# EAGLE design RelayController (EAGLE 7.6.0)

## Sheet 1 of 3
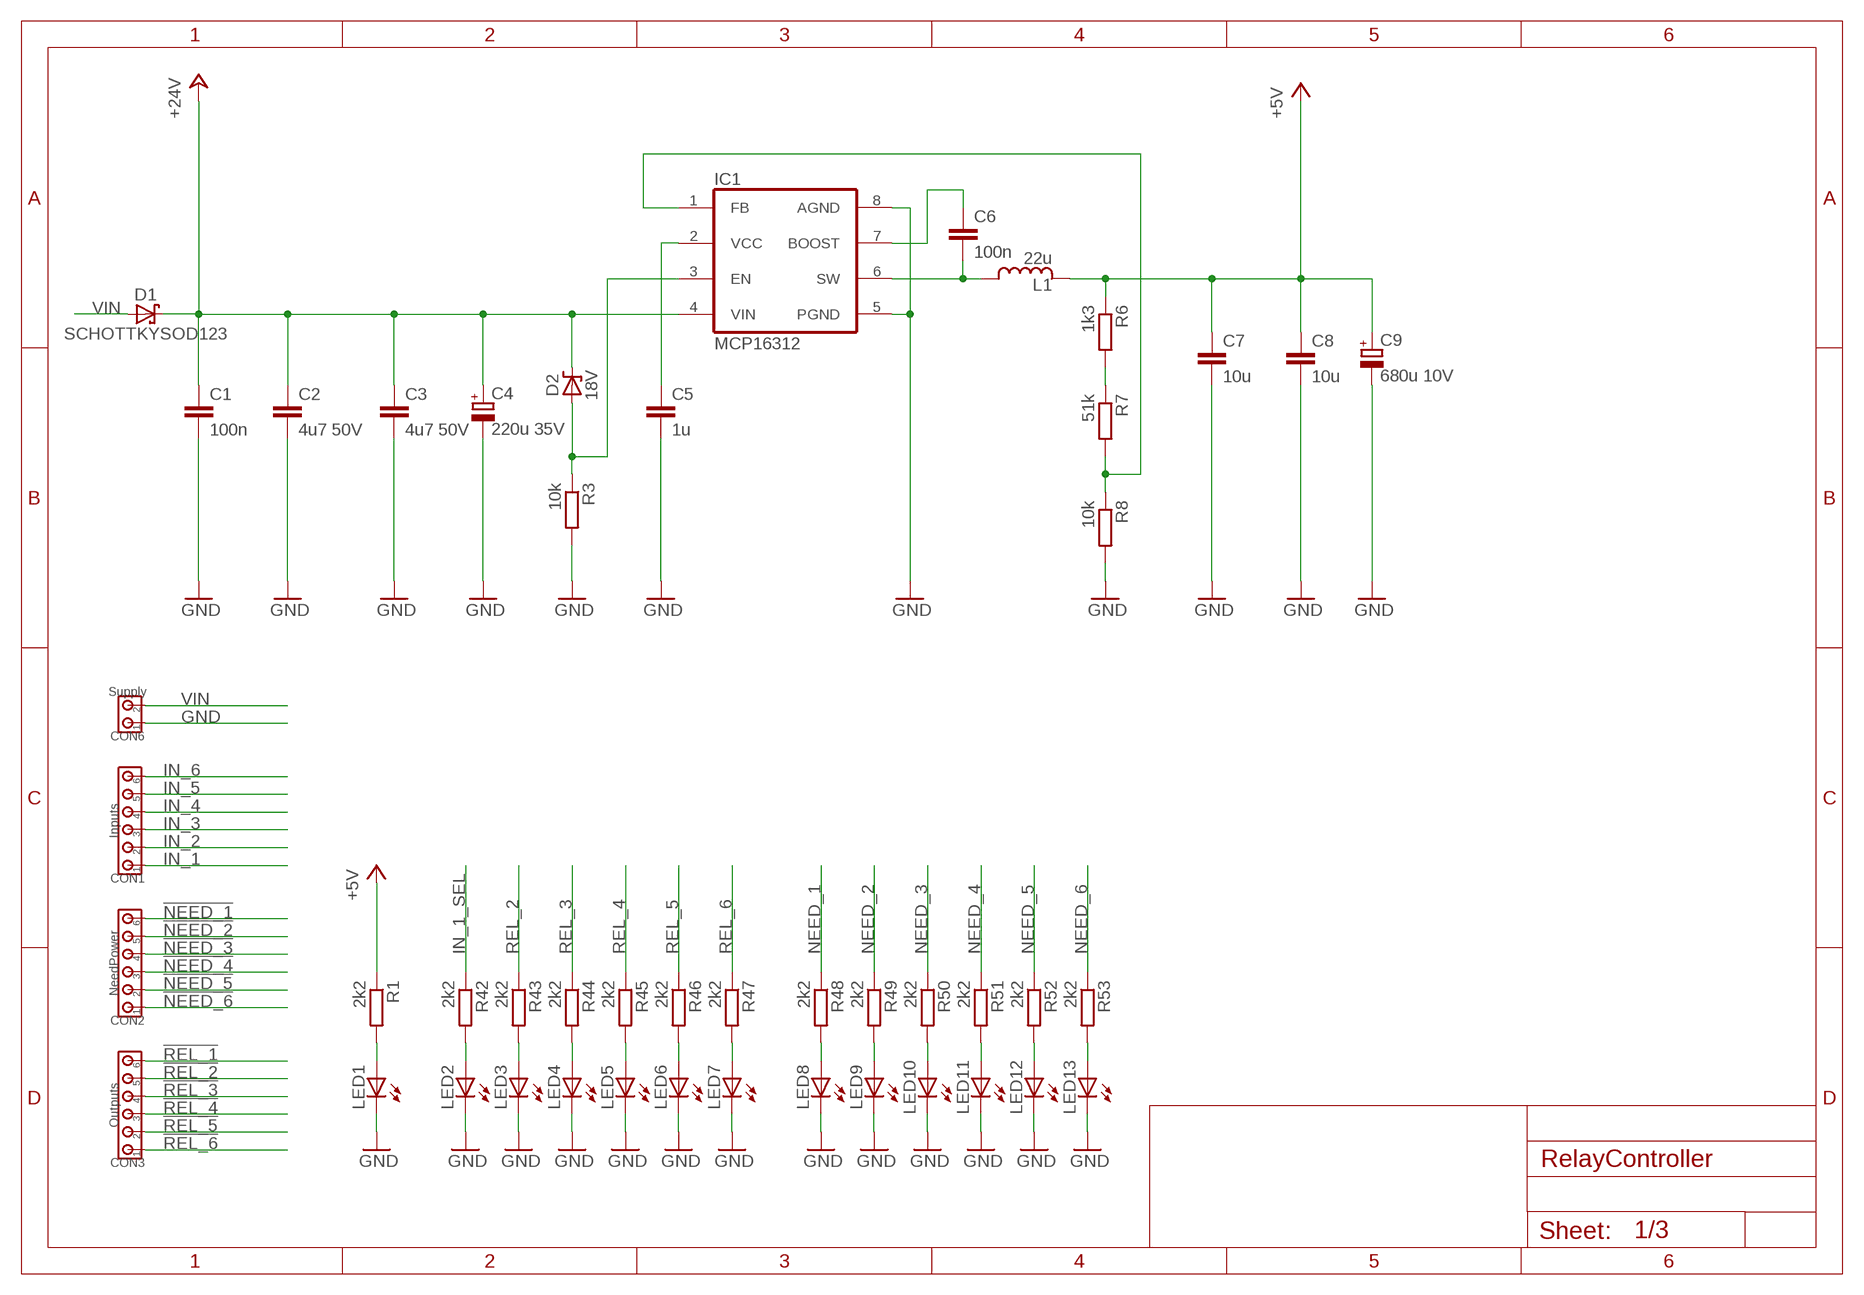
[diagram p0: schematic, sheet 1]

### Parts
C1  100n  CC0805  [C0805]
C2  4u7 50V  CC1206  [C1206]
C3  4u7 50V  CC1206  [C1206]
C4  220u 35V  C_POLARIZED8MM  [8MM]
C5  1u  CC0805  [C0805]
C6  100n  CC0805  [C0805]
C7  10u  CC0805  [C0805]
C8  10u  CC0805  [C0805]
C9  680u 10V  C_POLARIZED8MM  [8MM]
CON1  Inputs  CON_6X3.5MM  [3.5MM_6X]
CON2  NeedPower  CON_6X3.5MM  [3.5MM_6X]
CON3  Outputs  CON_6X3.5MM  [3.5MM_6X]
CON6  Supply  CON_2X3.5MM  [3.5MM_2X]
D1  SCHOTTKYSOD123  [SOD123]
D2  18V  ZENERSOD323  [SOD323]
IC1  MCP16312  MCP16311  [MSOP8]
L1  22u  INDUCTORSRN5040  [SRN5040]
LED1  LED0805_NB  [LED0805_NOBOARDER]
LED2  LED0805_NB  [LED0805_NOBOARDER]
LED3  LED0805_NB  [LED0805_NOBOARDER]
LED4  LED0805_NB  [LED0805_NOBOARDER]
LED5  LED0805_NB  [LED0805_NOBOARDER]
LED6  LED0805_NB  [LED0805_NOBOARDER]
LED7  LED0805_NB  [LED0805_NOBOARDER]
LED8  LED0805_NB  [LED0805_NOBOARDER]
LED9  LED0805_NB  [LED0805_NOBOARDER]
LED10  LED0805_NB  [LED0805_NOBOARDER]
LED11  LED0805_NB  [LED0805_NOBOARDER]
LED12  LED0805_NB  [LED0805_NOBOARDER]
LED13  LED0805_NB  [LED0805_NOBOARDER]
R1  2k2  RESISTORR0805  [R0805]
R3  10k  RESISTORR0805  [R0805]
R6  1k3  RESISTORR0805  [R0805]
R7  51k  RESISTORR0805  [R0805]
R8  10k  RESISTORR0805  [R0805]
R42  2k2  RESISTORR0805  [R0805]
R43  2k2  RESISTORR0805  [R0805]
R44  2k2  RESISTORR0805  [R0805]
R45  2k2  RESISTORR0805  [R0805]
R46  2k2  RESISTORR0805  [R0805]
R47  2k2  RESISTORR0805  [R0805]
R48  2k2  RESISTORR0805  [R0805]
R49  2k2  RESISTORR0805  [R0805]
R50  2k2  RESISTORR0805  [R0805]
R51  2k2  RESISTORR0805  [R0805]
R52  2k2  RESISTORR0805  [R0805]
R53  2k2  RESISTORR0805  [R0805]

### Nets
!NEED_1!: CON2.6 ; also sheet 2
!NEED_2!: CON2.5 ; also sheet 2
!NEED_3!: CON2.4 ; also sheet 2
!NEED_4!: CON2.3 ; also sheet 2
!NEED_5!: CON2.2 ; also sheet 2
!NEED_6!: CON2.1 ; also sheet 2
!REL_1!: CON3.6 ; also sheet 3
!REL_2!: CON3.5 ; also sheet 3
!REL_3!: CON3.4 ; also sheet 3
!REL_4!: CON3.3 ; also sheet 3
!REL_5!: CON3.2 ; also sheet 3
!REL_6!: CON3.1 ; also sheet 3
+5V: C7.1 C8.1 C9.+ L1.2 R1.1 R6.1 ; also sheet 2,3
+24V: C1.1 C2.1 C3.1 C4.+ D1.C D2.C IC1.4(VIN) ; also sheet 2,3
BOOST: C6.1 IC1.7(BOOST)
GND: C1.2 C2.2 C3.2 C4.- C5.2 C7.2 C8.2 C9.- CON6.1 IC1.5(PGND) IC1.8(AGND) LED1.C LED2.C LED3.C LED4.C LED5.C LED6.C LED7.C LED8.C LED9.C LED10.C LED11.C LED12.C LED13.C R3.2 R8.2 ; also sheet 2,3
IN_1: CON1.1 ; also sheet 2
IN_1_SEL: R42.1 ; also sheet 2
IN_2: CON1.2 ; also sheet 2
IN_3: CON1.3 ; also sheet 2
IN_4: CON1.4 ; also sheet 2
IN_5: CON1.5 ; also sheet 2
IN_6: CON1.6 ; also sheet 2
N$1: IC1.1(FB) R7.2 R8.1
N$6: LED1.A R1.2
N$8: D2.A IC1.3(EN) R3.1
N$13: R6.2 R7.1
N$14: C5.1 IC1.2(VCC)
N$17: LED2.A R42.2
N$18: LED3.A R43.2
N$19: LED4.A R44.2
N$20: LED5.A R45.2
N$21: LED6.A R46.2
N$22: LED7.A R47.2
N$23: LED8.A R48.2
N$24: LED9.A R49.2
N$25: LED10.A R50.2
N$26: LED11.A R51.2
N$27: LED12.A R52.2
N$28: LED13.A R53.2
NEED_1: R48.1 ; also sheet 2
NEED_2: R49.1 ; also sheet 2
NEED_3: R50.1 ; also sheet 2
NEED_4: R51.1 ; also sheet 2
NEED_5: R52.1 ; also sheet 2
NEED_6: R53.1 ; also sheet 2
REL_2: R43.1 ; also sheet 2,3
REL_3: R44.1 ; also sheet 2,3
REL_4: R45.1 ; also sheet 2,3
REL_5: R46.1 ; also sheet 2,3
REL_6: R47.1 ; also sheet 2,3
SWITCH: C6.2 IC1.6(SW) L1.1
VIN: CON6.2 D1.A

## Sheet 2 of 3
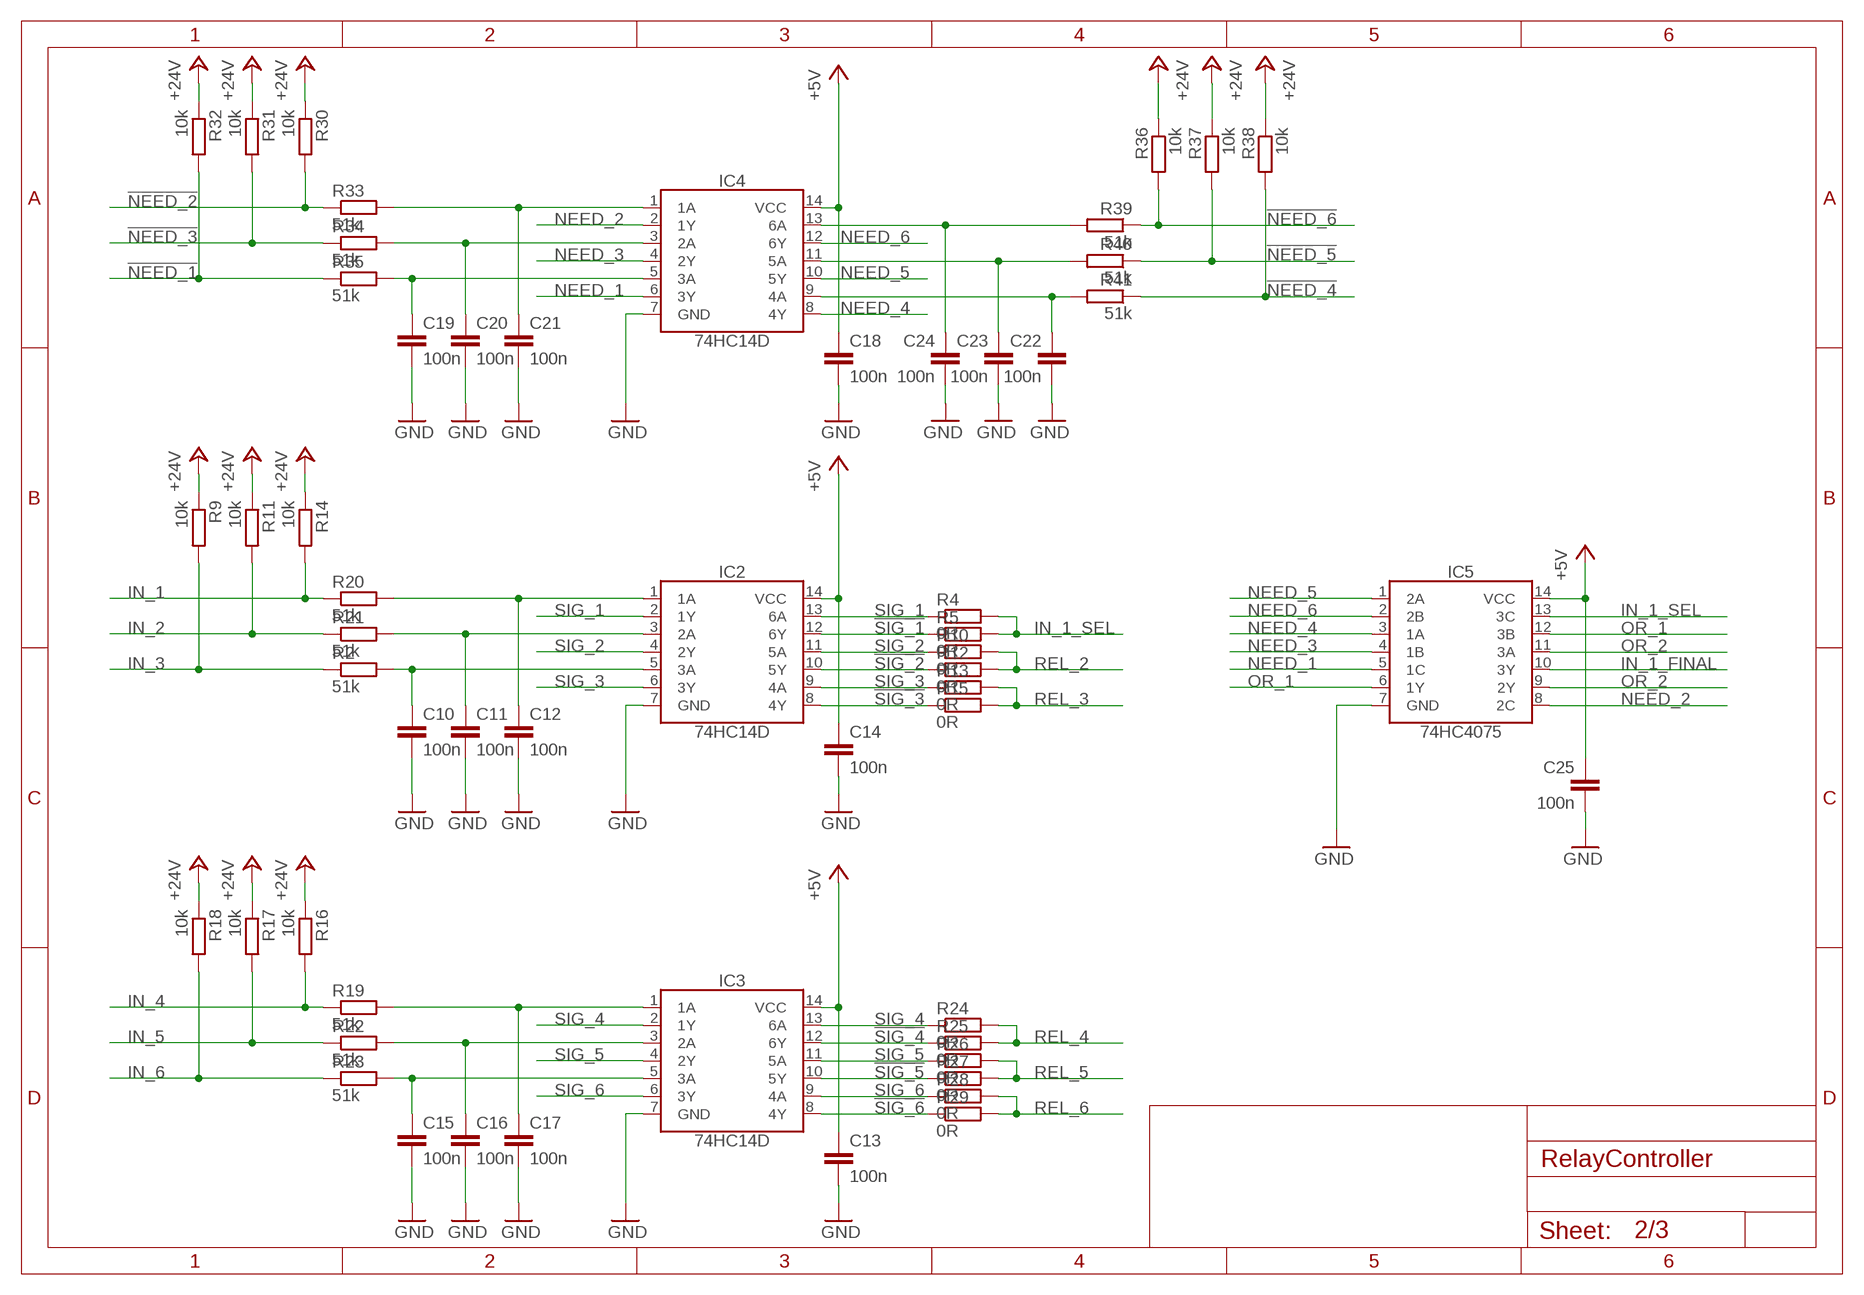
[diagram p1: schematic, sheet 2]

### Parts
C10  100n  CC0805  [C0805]
C11  100n  CC0805  [C0805]
C12  100n  CC0805  [C0805]
C13  100n  CC0805  [C0805]
C14  100n  CC0805  [C0805]
C15  100n  CC0805  [C0805]
C16  100n  CC0805  [C0805]
C17  100n  CC0805  [C0805]
C18  100n  CC0805  [C0805]
C19  100n  CC0805  [C0805]
C20  100n  CC0805  [C0805]
C21  100n  CC0805  [C0805]
C22  100n  CC0805  [C0805]
C23  100n  CC0805  [C0805]
C24  100n  CC0805  [C0805]
C25  100n  CC0805  [C0805]
IC2  74HC14D  [SO14]
IC3  74HC14D  [SO14]
IC4  74HC14D  [SO14]
IC5  74HC4075  [SO14]
R2  51k  RESISTORR0805  [R0805]
R4  0R  RESISTORR0805  [R0805]
R5  0R  RESISTORR0805  [R0805]
R9  10k  RESISTORR0805  [R0805]
R10  0R  RESISTORR0805  [R0805]
R11  10k  RESISTORR0805  [R0805]
R12  0R  RESISTORR0805  [R0805]
R13  0R  RESISTORR0805  [R0805]
R14  10k  RESISTORR0805  [R0805]
R15  0R  RESISTORR0805  [R0805]
R16  10k  RESISTORR0805  [R0805]
R17  10k  RESISTORR0805  [R0805]
R18  10k  RESISTORR0805  [R0805]
R19  51k  RESISTORR0805  [R0805]
R20  51k  RESISTORR0805  [R0805]
R21  51k  RESISTORR0805  [R0805]
R22  51k  RESISTORR0805  [R0805]
R23  51k  RESISTORR0805  [R0805]
R24  0R  RESISTORR0805  [R0805]
R25  0R  RESISTORR0805  [R0805]
R26  0R  RESISTORR0805  [R0805]
R27  0R  RESISTORR0805  [R0805]
R28  0R  RESISTORR0805  [R0805]
R29  0R  RESISTORR0805  [R0805]
R30  10k  RESISTORR0805  [R0805]
R31  10k  RESISTORR0805  [R0805]
R32  10k  RESISTORR0805  [R0805]
R33  51k  RESISTORR0805  [R0805]
R34  51k  RESISTORR0805  [R0805]
R35  51k  RESISTORR0805  [R0805]
R36  10k  RESISTORR0805  [R0805]
R37  10k  RESISTORR0805  [R0805]
R38  10k  RESISTORR0805  [R0805]
R39  51k  RESISTORR0805  [R0805]
R40  51k  RESISTORR0805  [R0805]
R41  51k  RESISTORR0805  [R0805]

### Nets
!NEED_1!: R32.2 R35.1 ; also sheet 1
!NEED_2!: R30.2 R33.1 ; also sheet 1
!NEED_3!: R31.2 R34.1 ; also sheet 1
!NEED_4!: R38.2 R41.1 ; also sheet 1
!NEED_5!: R37.2 R40.1 ; also sheet 1
!NEED_6!: R36.2 R39.1 ; also sheet 1
!SIG_1!: IC2.12(6Y) R5.1
!SIG_2!: IC2.10(5Y) R12.1
!SIG_3!: IC2.8(4Y) R15.1
!SIG_4!: IC3.12(6Y) R25.1
!SIG_5!: IC3.10(5Y) R27.1
!SIG_6!: IC3.8(4Y) R29.1
+5V: C13.1 C14.1 C18.1 C25.1 IC2.14(VCC) IC3.14(VCC) IC4.14(VCC) IC5.14(VCC) ; also sheet 1,3
+24V: R9.1 R11.1 R14.1 R16.1 R17.1 R18.1 R30.1 R31.1 R32.1 R36.1 R37.1 R38.1 ; also sheet 1,3
FOO: C10.1 IC2.5(3A) R2.2
FOO1: C15.1 IC3.5(3A) R23.2
GND: C10.2 C11.2 C12.2 C13.2 C14.2 C15.2 C16.2 C17.2 C18.2 C19.2 C20.2 C21.2 C22.2 C23.2 C24.2 C25.2 IC2.7(GND) IC3.7(GND) IC4.7(GND) IC5.7(GND) ; also sheet 1,3
IN_1: R14.2 R20.1 ; also sheet 1
IN_1_FINAL: IC5.10(3Y) ; also sheet 3
IN_1_SEL: IC5.13(3C) R4.2 R5.2 ; also sheet 1
IN_2: R11.2 R21.1 ; also sheet 1
IN_3: R2.1 R9.2 ; also sheet 1
IN_4: R16.2 R19.1 ; also sheet 1
IN_5: R17.2 R22.1 ; also sheet 1
IN_6: R18.2 R23.1 ; also sheet 1
N$2: C17.1 IC3.1(1A) R19.2
N$4: C16.1 IC3.3(2A) R22.2
N$5: C21.1 IC4.1(1A) R33.2
N$11: C20.1 IC4.3(2A) R34.2
N$12: C24.1 IC4.13(6A) R39.2
N$15: C23.1 IC4.11(5A) R40.2
N$16: C22.1 IC4.9(4A) R41.2
N$40: C12.1 IC2.1(1A) R20.2
N$41: C11.1 IC2.3(2A) R21.2
N$111: C19.1 IC4.5(3A) R35.2
NEED_1: IC4.6(3Y) IC5.5(1C) ; also sheet 1
NEED_2: IC4.2(1Y) IC5.8(2C) ; also sheet 1
NEED_3: IC4.4(2Y) IC5.4(1B) ; also sheet 1
NEED_4: IC4.8(4Y) IC5.3(1A) ; also sheet 1
NEED_5: IC4.10(5Y) IC5.1(2A) ; also sheet 1
NEED_6: IC4.12(6Y) IC5.2(2B) ; also sheet 1
OR_1: IC5.6(1Y) IC5.12(3B)
OR_2: IC5.9(2Y) IC5.11(3A)
REL_2: R10.2 R12.2 ; also sheet 1,3
REL_3: R13.2 R15.2 ; also sheet 1,3
REL_4: R24.2 R25.2 ; also sheet 1,3
REL_5: R26.2 R27.2 ; also sheet 1,3
REL_6: R28.2 R29.2 ; also sheet 1,3
SIG_1: IC2.2(1Y) IC2.13(6A) R4.1
SIG_2: IC2.4(2Y) IC2.11(5A) R10.1
SIG_3: IC2.6(3Y) IC2.9(4A) R13.1
SIG_4: IC3.2(1Y) IC3.13(6A) R24.1
SIG_5: IC3.4(2Y) IC3.11(5A) R26.1
SIG_6: IC3.6(3Y) IC3.9(4A) R28.1

## Sheet 3 of 3
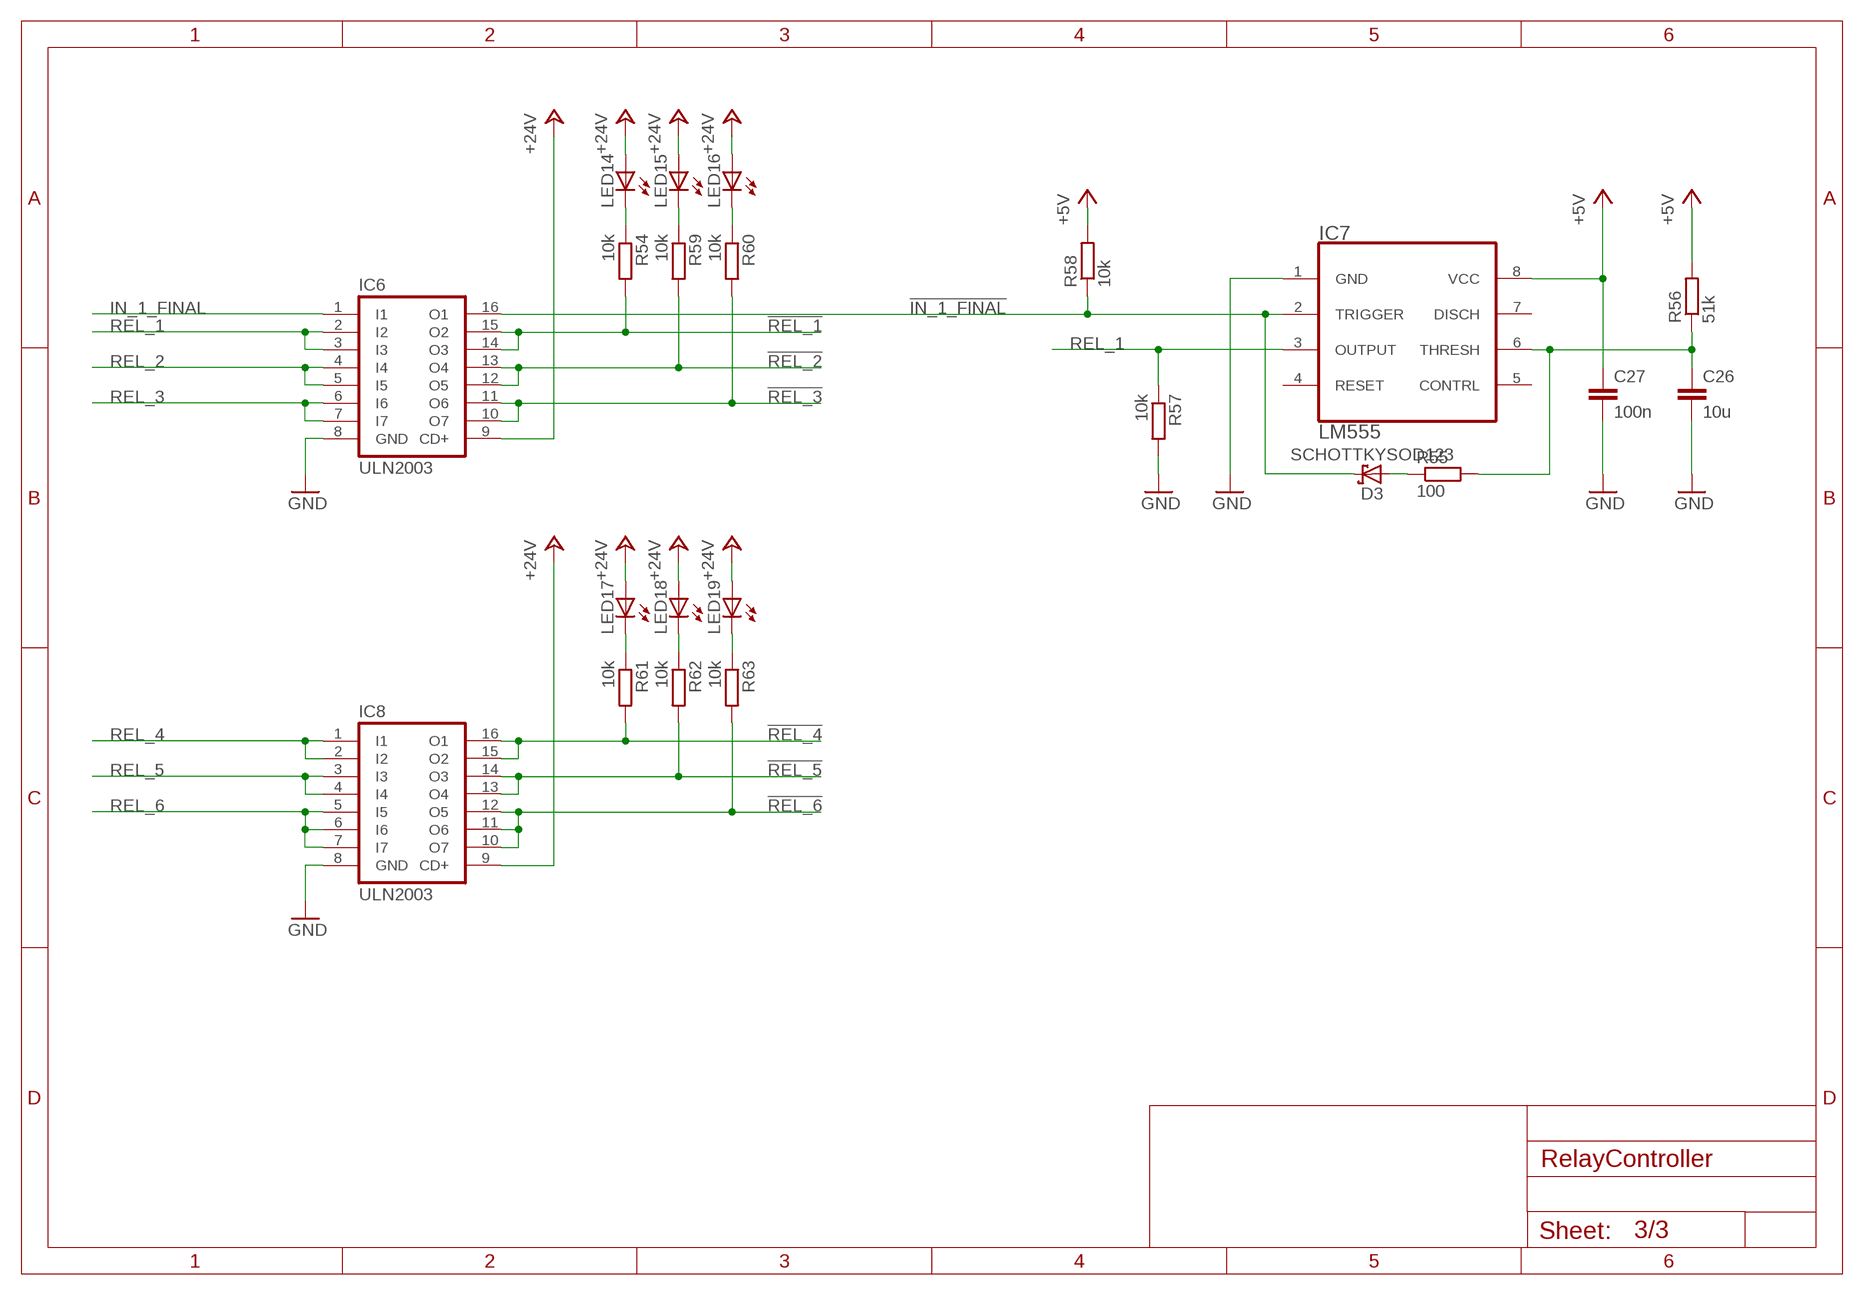
[diagram p2: schematic, sheet 3]

### Parts
C26  10u  CC0805  [C0805]
C27  100n  CC0805  [C0805]
D3  SCHOTTKYSOD123  [SOD123]
IC6  ULN2003  [SO16]
IC7  LM555  [SOIC8]
IC8  ULN2003  [SO16]
LED14  LED0805_NB  [LED0805_NOBOARDER]
LED15  LED0805_NB  [LED0805_NOBOARDER]
LED16  LED0805_NB  [LED0805_NOBOARDER]
LED17  LED0805_NB  [LED0805_NOBOARDER]
LED18  LED0805_NB  [LED0805_NOBOARDER]
LED19  LED0805_NB  [LED0805_NOBOARDER]
R54  10k  RESISTORR0805  [R0805]
R55  100  RESISTORR0805  [R0805]
R56  51k  RESISTORR0805  [R0805]
R57  10k  RESISTORR0805  [R0805]
R58  10k  RESISTORR0805  [R0805]
R59  10k  RESISTORR0805  [R0805]
R60  10k  RESISTORR0805  [R0805]
R61  10k  RESISTORR0805  [R0805]
R62  10k  RESISTORR0805  [R0805]
R63  10k  RESISTORR0805  [R0805]

### Nets
!IN_1_FINAL!: D3.C IC6.16(O1) IC7.2(TRIGGER) R58.1
!REL_1!: IC6.14(O3) IC6.15(O2) R54.2 ; also sheet 1
!REL_2!: IC6.12(O5) IC6.13(O4) R59.2 ; also sheet 1
!REL_3!: IC6.10(O7) IC6.11(O6) R60.2 ; also sheet 1
!REL_4!: IC8.15(O2) IC8.16(O1) R61.2 ; also sheet 1
!REL_5!: IC8.13(O4) IC8.14(O3) R62.2 ; also sheet 1
!REL_6!: IC8.10(O7) IC8.11(O6) IC8.12(O5) R63.2 ; also sheet 1
+5V: C27.1 IC7.8(VCC) R56.2 R58.2 ; also sheet 1,2
+24V: IC6.9(CD+) IC8.9(CD+) LED14.A LED15.A LED16.A LED17.A LED18.A LED19.A ; also sheet 1,2
GND: C26.2 C27.2 IC6.8(GND) IC7.1(GND) IC8.8(GND) R57.2 ; also sheet 1,2
IN_1_FINAL: IC6.1(I1) ; also sheet 2
N$29: C26.1 IC7.6(THRESH) R55.2 R56.1
N$30: D3.A R55.1
N$31: LED16.C R60.1
N$32: LED15.C R59.1
N$33: LED14.C R54.1
N$34: LED17.C R61.1
N$35: LED18.C R62.1
N$36: LED19.C R63.1
REL_1: IC6.2(I2) IC6.3(I3) IC7.3(OUTPUT) R57.1
REL_2: IC6.4(I4) IC6.5(I5) ; also sheet 1,2
REL_3: IC6.6(I6) IC6.7(I7) ; also sheet 1,2
REL_4: IC8.1(I1) IC8.2(I2) ; also sheet 1,2
REL_5: IC8.3(I3) IC8.4(I4) ; also sheet 1,2
REL_6: IC8.5(I5) IC8.6(I6) IC8.7(I7) ; also sheet 1,2
Unconnected: IC7.4(RESET) IC7.5(CONTRL) IC7.7(DISCH)

## Library data of the parts
C1-C3 C5-C8 C10-C27 = 00Capacitor:C: Capacitor
C4 C9 = 00Capacitor:C_POLARIZED
CON1-CON3 = 00Connector:CON_6X: 6-pin header
CON6 = 00Connector:CON_2X: 2-pin header
D1 D3 = 00Diode:SCHOTTKY
D2 = 00Diode:ZENER
IC1 = 00VoltageRegulator:MCP16311
IC2-IC4 = 00Logic:74HC14: Hex Inverter Schmitt Trigger
IC5 = 00Logic:74HC4075: Triple 3-input OR gate
IC6 IC8 = 00Transistor:ULN2003: Seven Darlington array
IC7 = 00Logic:LM555
L1 = 00Inductor:INDUCTOR
LED1-LED19 = 00Display:LED: LED
R1-R63 = 00Resistor:RESISTOR: RESISTOR, European symbol

## Net classes
1 24V: clearance 0.305 mm
5 +5v: width 0.61 mm, drill 0.6 mm, clearance 0.254 mm to class 0, clearance 0.254 mm to class 1, clearance 0.254 mm to class 2, clearance 0.254 mm to class 3, clearance 0.254 mm to class 4, clearance 0.254 mm

## Board
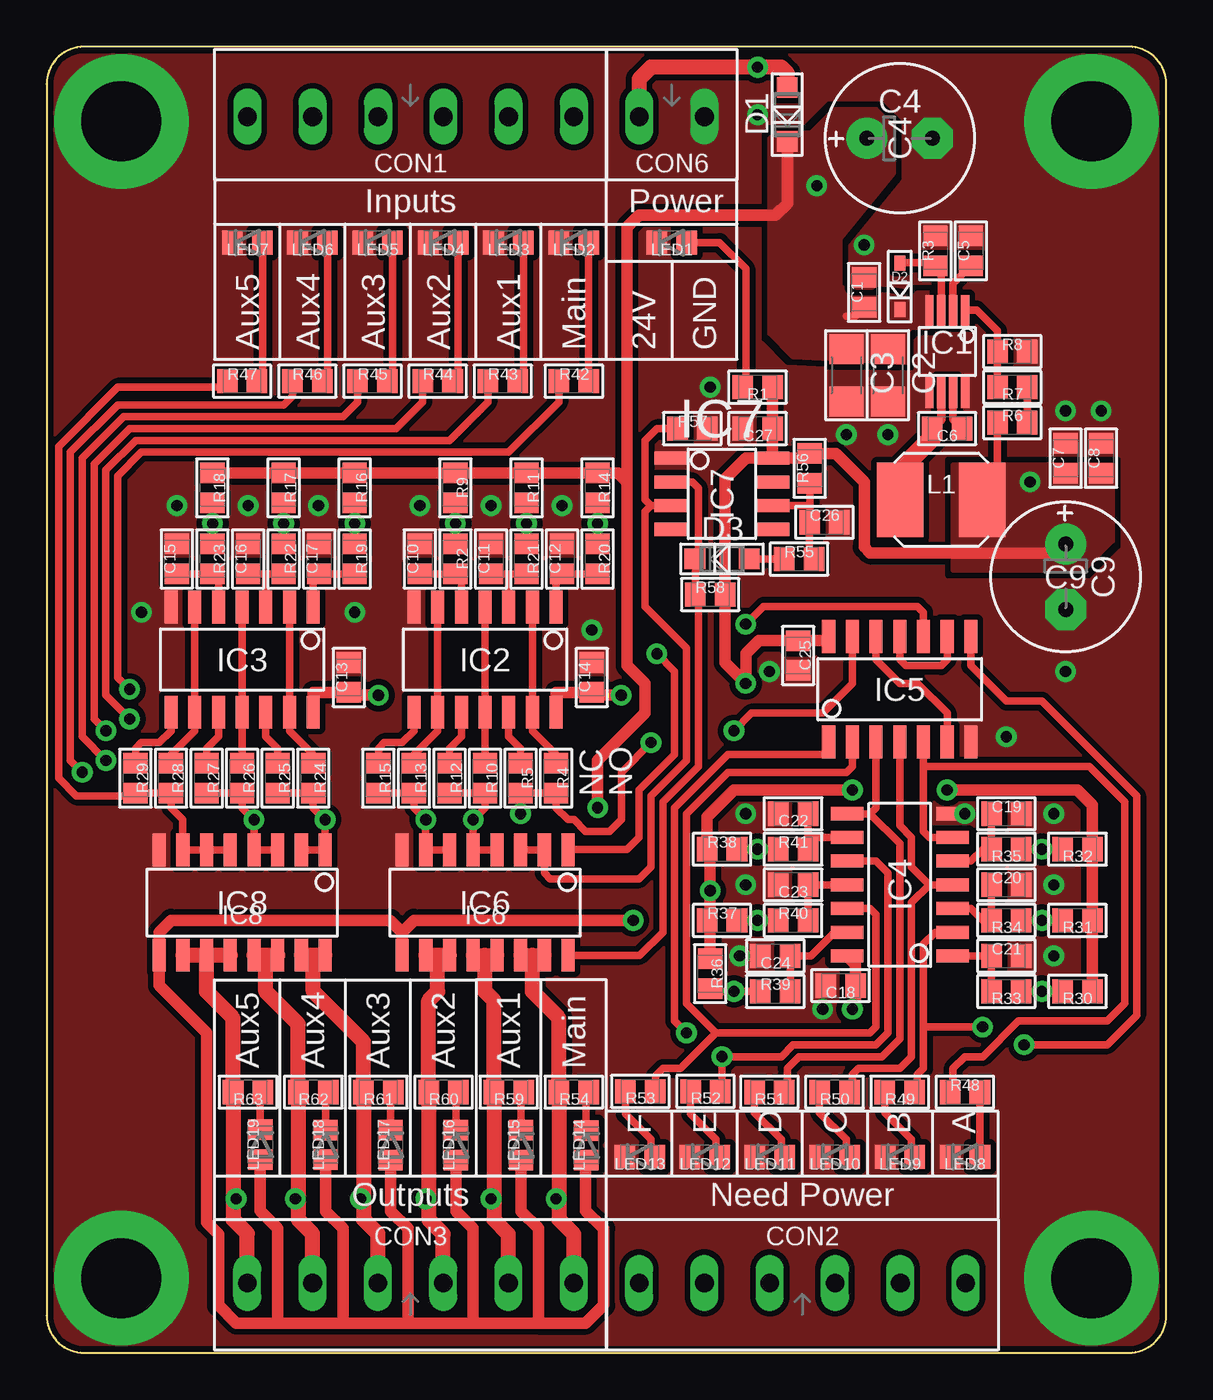
[diagram p3: board, top side]
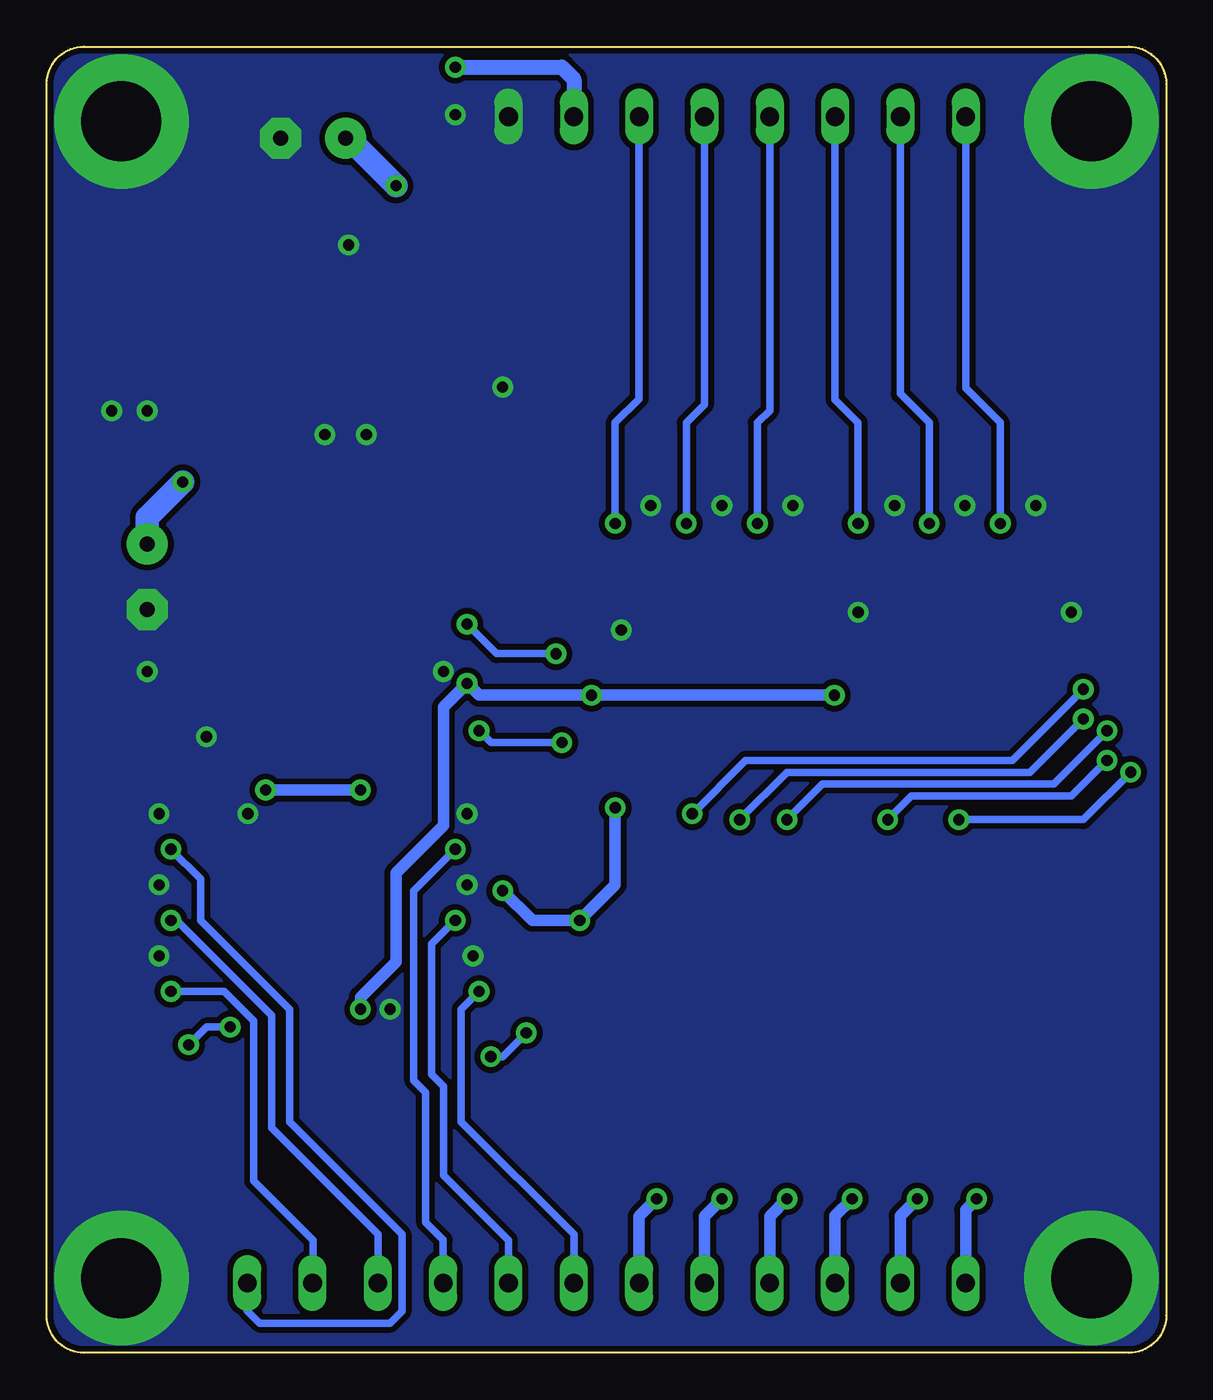
[diagram p4: board, bottom side, seen from below]

Size 60 x 70 mm. Coordinates in mm from the lower left corner, seen from the top.
Outline: 58,0 arc90 60,2 60,68 arc90 58,70 2,70 arc90 0,68 0,2 arc90 2,0 58,0
Copper layers (1*16): Top 0.035mm / dielectric 1.5mm / Bottom 0.035mm
Design rules "LPKF_Compatible": minimum track width 8mil, minimum drill 23mil, track to track 8mil, track to pad 8mil, pad to pad 8mil, via to via 8mil, smd to smd 0mil, copper to edge 10mil, drill to drill 10mil, minimum pad ring 10mil, minimum via ring 10mil, stop-mask expansion 2mil, vias tented up to drill 25mil, thermal gap 10mil

### Footprints (pad centres in the part's own frame; a part is rotated, then mirrored left to right if it is on the bottom)
C0805 = smd 1.1 x 1.3: 1 -0.8,0; 2 0.8,0
C1206 = smd 1.6 x 1.8: 1 -1.4,0; 2 1.4,0
8MM = drill 0.8 pad 2.2: + -1.75,0 | drill 0.8 pad 2.2 octagon: - 1.75,0
3.5MM_6X = drill 1 long: 1 -8.75,0; 2 -5.25,0; 3 -1.75,0; 4 1.75,0; 5 5.25,0; 6 8.75,0
3.5MM_2X = drill 1 long: 1 -1.75,0; 2 1.75,0
SOD123 = smd 1.1 x 1.1: A 1.45,0; C -1.45,0
SOD323 = smd 0.8 x 0.6: A 1.25,0; C -1.25,0
MSOP8 = smd 1.65 x 0.45: 1 -2.2,0.953; 2 -2.2,0.318; 3 -2.2,-0.318; 4 -2.2,-0.953; 5 2.2,-0.953; 6 2.2,-0.318; 7 2.2,0.318; 8 2.2,0.953
SO14 = smd 0.7 x 1.75: 1 -3.81,-2.825; 2 -2.54,-2.825; 3 -1.27,-2.825; 4 0,-2.825; 5 1.27,-2.825; 6 2.54,-2.825; 7 3.81,-2.825; 8 3.81,2.825; 9 2.54,2.825; 10 1.27,2.825; 11 0,2.825; 12 -1.27,2.825; 13 -2.54,2.825; 14 -3.81,2.825
SO16 = smd 0.7 x 1.75: 1 -4.445,-2.825; 2 -3.175,-2.825; 3 -1.905,-2.825; 4 -0.635,-2.825; 5 0.635,-2.825; 6 1.905,-2.825; 7 3.175,-2.825; 8 4.445,-2.825; 9 4.445,2.825; 10 3.175,2.825; 11 1.905,2.825; 12 0.635,2.825; 13 -0.635,2.825; 14 -1.905,2.825; 15 -3.175,2.825; 16 -4.445,2.825
SOIC8 = smd 1.75 x 0.7: 1 -2.75,1.905; 2 -2.75,0.635; 3 -2.75,-0.635; 4 -2.75,-1.905; 5 2.75,-1.905; 6 2.75,-0.635; 7 2.75,0.635; 8 2.75,1.905
SRN5040 = smd 2.5 x 4: 1 -2.2,0; 2 2.2,0
LED0805_NOBOARDER = smd 1.1 x 1.3: A -0.8,0; C 0.8,0
R0805 = smd 1.1 x 1.3: 1 -0.8,0; 2 0.8,0

### Placement (x,y rotation side)
C1  43.81,56.83 90 top
C2  45.09,52.39 270 top
C3  42.86,52.39 270 top
C4  45.72,65.09 0 top
C5  49.53,59.05 90 top
C6  48.26,49.53 180 top
C7  54.61,47.94 90 top
C8  56.52,47.94 90 top
C9  54.61,41.59 270 top
C10  20,42.55 90 top
C11  23.81,42.55 90 top
C12  27.62,42.55 90 top
C13  16.19,36.2 90 top
C14  29.21,36.2 90 top
C15  6.99,42.55 90 top
C16  10.79,42.55 90 top
C17  14.61,42.55 90 top
C18  42.55,19.68 180 top
C19  51.44,28.89 0 top
C20  51.44,25.08 0 top
C21  51.44,21.27 0 top
C22  40.01,28.89 180 top
C23  40.01,25.08 180 top
C24  39.05,21.27 180 top
C25  40.28,37.37 270 top
C26  41.69,44.51 0 top
C27  38.1,49.53 180 top
CON1  19.5,66.25 180 top
CON2  40.5,3.75 0 top
CON3  19.5,3.75 0 top
CON6  33.5,66.25 180 top
D1  39.69,66.36 90 top
D2  45.72,57.15 90 top
D3  36.2,42.55 0 top
IC1  48.26,53.66 270 top
IC2  23.5,37.15 180 top
IC3  10.48,37.15 180 top
IC4  45.72,25.08 90 top
IC5  45.72,35.56 0 top
IC6  23.5,24.13 180 top
IC7  36.2,46.04 0 top
IC8  10.48,24.13 180 top
L1  47.94,45.72 0 top
LED1  33.5,59.5 180 top
LED2  28.25,59.5 180 top
LED3  24.75,59.5 180 top
LED4  21.25,59.5 180 top
LED5  17.73,59.5 180 top
LED6  14.25,59.5 180 top
LED7  10.77,59.5 180 top
LED8  49.21,10.5 180 top
LED9  45.73,10.5 180 top
LED10  42.24,10.5 180 top
LED11  38.76,10.5 180 top
LED12  35.27,10.5 180 top
LED13  31.79,10.5 180 top
LED14  28.91,11.12 90 top
LED15  25.42,11.13 90 top
LED16  21.93,11.13 90 top
LED17  18.44,11.14 90 top
LED18  14.95,11.15 90 top
LED19  11.45,11.16 90 top
R1  38.1,51.75 180 top
R2  21.91,42.55 270 top
R3  47.62,59.05 90 top
R4  27.3,30.8 270 top
R5  25.4,30.8 270 top
R6  51.75,49.85 0 top
R7  51.75,51.75 180 top
R8  51.75,53.66 0 top
R9  21.91,46.35 270 top
R10  23.5,30.8 270 top
R11  25.72,46.35 270 top
R12  21.59,30.8 270 top
R13  19.68,30.8 270 top
R14  29.53,46.35 270 top
R15  17.78,30.8 270 top
R16  16.51,46.35 270 top
R17  12.7,46.35 270 top
R18  8.89,46.35 270 top
R19  16.51,42.55 270 top
R20  29.53,42.55 270 top
R21  25.72,42.55 270 top
R22  12.7,42.55 270 top
R23  8.89,42.55 270 top
R24  14.29,30.8 270 top
R25  12.38,30.8 270 top
R26  10.48,30.8 270 top
R27  8.57,30.8 270 top
R28  6.67,30.8 270 top
R29  4.76,30.8 270 top
R30  55.24,19.37 180 top
R31  55.24,23.18 180 top
R32  55.24,26.99 180 top
R33  51.44,19.37 180 top
R34  51.44,23.18 180 top
R35  51.44,26.99 180 top
R36  35.56,20.32 270 top
R37  36.2,23.18 0 top
R38  36.2,26.99 0 top
R39  39.05,19.37 0 top
R40  40.01,23.18 0 top
R41  40.01,26.99 0 top
R42  28.26,52.07 0 top
R43  24.45,52.07 0 top
R44  20.95,52.07 0 top
R45  17.46,52.07 0 top
R46  13.97,52.07 0 top
R47  10.48,52.07 0 top
R48  49.21,13.97 0 top
R49  45.72,13.97 180 top
R50  42.23,13.97 180 top
R51  38.73,13.97 180 top
R52  35.31,14.02 180 top
R53  31.82,14.02 180 top
R54  28.26,13.97 180 top
R55  40.32,42.55 0 top
R56  40.9,47.4 90 top
R57  34.61,49.53 0 top
R58  35.56,40.64 0 top
R59  24.77,13.97 180 top
R60  21.27,13.97 180 top
R61  17.78,13.97 180 top
R62  14.29,13.97 180 top
R63  10.79,13.97 180 top

### Tracks (layer width: path | path; a pad name or v marks a point on that pad's centre or on a via)
!IN_1_FINAL!
  Top 0.406: IC6.16 31.78,21.3 33.02,22.54 33.02,29.53 34.92,31.43 34.92,40.48 R58.1 34.76,42.53 D3.C 34.92,42.73 34.92,46.35 34.61,46.67 IC7.2
!NEED_1!  (via drill 0.6)
  Top 0.406: R32.2 v53.34,26.99 R35.1
  Bottom 0.406: CON2.6 49.25,2.26 48.58,1.59 41.59,1.59 40.96,2.22 40.96,6.35 46.99,12.38 46.99,18.41 51.75,23.18 51.75,25.4 v53.34,26.99
!NEED_2!  (via drill 0.6)
  Top 0.406: R30.2 v53.34,19.37 R33.1
  Bottom 0.406: CON2.5 45.72,3.78 45.72,6.03 48.9,9.21 48.9,17.78 50.48,19.37 v53.34,19.37
!NEED_3!  (via drill 0.6)
  Top 0.406: R31.2 v53.34,23.18 R34.1
  Bottom 0.406: CON2.4 42.23,3.77 42.23,6.35 47.94,12.06 47.94,18.1 53.02,23.18 v53.34,23.18
!NEED_4!  (via drill 0.6)
  Top 0.406: R41.1 v38.1,26.99 R38.2
  Bottom 0.406: CON2.3 38.75,6.05 39.69,6.99 39.69,13.97 40.32,14.61 40.32,24.77 v38.1,26.99
!NEED_5!  (via drill 0.6)
  Top 0.406: R37.2 v38.1,23.18 R40.1
  Bottom 0.406: CON2.2 35.25,6.04 38.73,9.53 38.73,14.29 39.37,14.92 39.37,21.91 v38.1,23.18
!NEED_6!  (via drill 0.6)
  Top 0.406: R39.1 v36.83,19.37 35.71,19.37 R36.2
  Bottom 0.406: CON2.1 31.75,6.35 37.78,12.38 37.78,18.41 v36.83,19.37
!REL_1!  (via drill 0.6)
  Top 0.813: IC6.14 26.04,21.3 | 26.04,21.3 IC6.15 | CON3.6 28.25,6.36 27.46,7.15 R54.2 27.46,17.95 26.04,19.37 26.04,21.3
  Bottom 0.61: v27.3,8.26 28.25,7.31 CON3.6
!REL_2!  (via drill 0.6)
  Top 0.813: CON3.5 24.75,6.37 23.96,7.15 R59.2 23.96,18.9 23.5,19.37 23.5,21.3 | IC6.12 23.5,21.3 | 23.5,21.3 IC6.13
  Bottom 0.61: v23.81,8.26 24.75,7.32 CON3.5
!REL_3!  (via drill 0.6)
  Top 0.813: CON3.4 21.25,6.37 20.47,7.15 R60.2 20.47,18.89 20.95,19.37 20.95,21.3 | IC6.11 20.95,21.3 | 20.95,21.3 IC6.10
  Bottom 0.61: v20.32,8.26 21.25,7.33 CON3.4
!REL_4!  (via drill 0.6)
  Top 0.813: IC8.16 14.29,21.3 | 14.29,21.3 IC8.15 | CON3.3 17.75,6.38 16.98,7.15 R61.2 16.98,16.68 14.29,19.37 14.29,21.3
  Bottom 0.61: v16.83,8.26 17.75,7.33 CON3.3
!REL_5!  (via drill 0.6)
  Top 0.813: IC8.14 11.75,21.3 | 11.75,21.3 IC8.13 | CON3.2 14.25,6.39 13.49,7.15 R62.2 13.49,17.63 11.75,19.37 11.75,21.3
  Bottom 0.61: v13.34,8.26 14.25,7.34 CON3.2
!REL_6!  (via drill 0.6)
  Top 0.813: IC8.12 IC8.11 | IC8.11 IC8.10 | CON3.1 10.75,6.39 9.99,7.15 R63.2 9.99,17.95 8.57,19.37 IC8.11
  Bottom 0.61: v10.16,8.26 10.75,7.67 CON3.1
!SIG_1!
  Top 0.406: IC2.12 24.77,33.02 25.4,32.38 R5.1
!SIG_2!
  Top 0.406: IC2.10 22.23,33.02 21.59,32.38 R12.1
!SIG_3!
  Top 0.406: IC2.8 19.68,33.34 19.05,32.7 18.1,32.7 17.78,32.38 R15.1
!SIG_4!
  Top 0.406: IC3.12 11.75,33.02 12.38,32.38 R25.1
!SIG_5!
  Top 0.406: IC3.10 9.21,33.02 8.57,32.38 R27.1
!SIG_6!
  Top 0.406: IC3.8 6.67,33.34 6.03,32.7 5.08,32.7 4.76,32.38 R29.1
+5V  (via drill 0.6)
  Top 0.406: R6.1 50.95,46.53 L1.2
  Top 0.61: IC5.14 41.7,38.17 C25.1 38.17,38.17 37.47,37.47 v37.47,35.88 36.36,36.98 R58.2 36.36,46.84 37.47,47.94 IC7.8 | IC7.8 38.9,47.99 C27.1 R1.1 | IC7.8 40.64,47.94 R56.2 42.29,48.2 43.81,46.67 43.81,43.18 44.13,42.86 54.13,42.86 C9.+ | IC4.14 43.34,20.82 C18.1 43.34,18.58 v43.18,18.41 | v17.78,35.24 16.34,35.24 C13.1 14.29,35.4 IC3.14 | v30.8,35.24 29.36,35.24 C14.1 27.3,35.4 IC2.14
  Bottom 0.61: v17.78,35.24 v30.8,35.24 36.83,35.24 v37.47,35.88 38.73,34.61 38.73,28.26 41.27,25.72 41.27,20.95 43.18,19.05 v43.18,18.41
  Bottom 1.27: v52.7,46.67 54.61,44.77 54.61,43.18
  pour Top (isolate 0.406, no thermals): 48.58,47.62 57.15,47.62 57.15,43.5 55.56,41.91 48.58,41.91
+24V  (via drill 0.6)
  Top 0.406: 42.86,55.56 43.34,55.56
  Top 0.61: R18.1 R17.1 R16.1 R9.1 R11.1 R14.1 30.63,47.16 31.11,46.67 | LED15.A 25.42,7.6 26.35,6.67 26.35,1.59 | 26.35,1.59 22.86,1.59 | 22.86,1.59 19.37,1.59 | 19.37,1.59 15.88,1.59 | 15.88,1.59 12.38,1.59 | 12.38,1.59 12.38,6.67 11.43,7.62 11.43,10.34 LED19.A | LED18.A 14.95,7.6 15.88,6.67 15.88,1.59 | LED17.A 18.44,7.6 19.37,6.67 19.37,1.59 | LED16.A 21.93,7.6 22.86,6.67 22.86,1.59 | 19.05,22.54 18.41,23.18 6.67,23.18 6.03,22.54 IC8.9 6.03,19.68 8.57,17.14 8.57,6.99 9.21,6.35 9.21,2.54 10.16,1.59 12.38,1.59 | 19.05,22.54 IC6.9 | 26.35,1.59 28.89,1.59 29.84,2.54 29.84,6.67 28.89,7.62 28.89,10.3 LED14.A | 19.05,22.54 19.68,23.18 v31.43,23.18 | R37.1 35.56,23.18 | R30.1 R31.1 R32.1 56.05,29.36 55.24,30.16 v48.26,30.16 | 35.56,23.18 v35.56,24.77 35.56,26.82 R38.1 35.4,28.73 36.83,30.16 v43.18,30.16 | 31.11,46.67 31.11,36.83 32.07,35.88 32.07,34.29 29.53,31.75 v29.53,29.21 | 31.11,46.67 31.11,60.33 31.75,60.96 39.05,60.96 39.69,61.59 D1.C | 35.56,23.18 R36.1
  Bottom 0.61: v48.26,30.16 v43.18,30.16 | v35.56,24.77 33.97,23.18 v31.43,23.18 29.53,25.08 v29.53,29.21
  Bottom 1.27: v41.27,62.55 43.81,65.09 44.13,65.09
  pour Top (isolate 0.406, no thermals): 47.31,56.83 47.31,54.93 46.35,54.93 46.04,54.61 46.04,53.02 40.01,53.34 38.73,54.61 38.73,65.09 39.05,65.41 40.96,65.41 42.23,66.67 44.45,66.67 45.4,65.72 45.4,63.18 42.55,59.69 42.55,57.15 46.35,56.52 46.67,56.83
BOOST
  Top 0.406: IC1.7 48.58,50.01 C6.1
FOO
  Top 0.406: C10.1 R2.2 22.23,41.43 IC2.5
FOO1
  Top 0.406: C15.1 R23.2 9.21,41.74 IC3.5
GND  (via drill 0.6, 4.3 pad 7.2)
  other vias: 4,66 56,66 56,4 4,4 42.86,49.21 45.09,49.21 43.81,59.37 5.08,39.69 53.98,21.27 53.98,25.08 14.56,45.4 27.62,45.4 20,45.4 37.47,28.89 53.98,28.89 10.79,45.4 23.81,45.4 6.99,45.4 37.47,25.08 16.51,39.69 37.15,21.27 41.59,18.41 51.44,33.02 49.21,28.89 35.56,51.75 38.73,36.51 29.21,38.73 54.61,50.48 56.52,50.48 54.61,36.51 38.1,66.36
  pour Bottom (isolate 0.305, rank 3, no thermals): 58,0 2,0 arc-90 0,2 0,68 arc-90 2,70 58,70 arc-90 60,68 60,2 arc-90
  pour Top (isolate 0.305, rank 3, no thermals): 0,2 0,68 arc-90 2,70 58,70 arc-90 60,68 60,2 arc-90 58,0 2,0 arc-90
IN_1  (via drill 0.6)
  Top 0.406: R20.1 v29.53,44.45 R14.2
  Bottom 0.406: CON1.1 28.25,51.12 29.53,49.85 v29.53,44.45
IN_1_FINAL  (via drill 0.6)
  Top 0.406: IC6.1 27.94,26.99 31.11,26.99 31.75,27.62 31.75,30.16 33.66,32.07 33.66,36.51 v32.7,37.47 | IC5.10 46.99,39.69 46.67,40.01 38.42,40.01 v37.47,39.05
  Bottom 0.406: v32.7,37.47 35.88,37.47 v37.47,39.05
IN_1_SEL  (via drill 0.6)
  Top 0.406: R42.1 27.46,50.95 24.77,48.26 5.08,48.26 3.81,46.99 3.81,36.2 v4.45,35.56 | v25.4,28.89 R5.2 R4.2 27.3,29.21 27.94,28.57 28.26,28.57 28.89,27.94 30.16,27.94 30.8,28.57 30.8,31.11 v32.38,32.7 | IC5.13 43.18,35.88 41.59,34.29 37.78,34.29 v36.83,33.34
  Bottom 0.406: v4.45,35.56 8.26,31.75 22.54,31.75 v25.4,28.89 | v32.38,32.7 36.2,32.7 v36.83,33.34
IN_2  (via drill 0.6)
  Top 0.406: R21.1 v25.72,44.45 R11.2
  Bottom 0.406: CON1.2 24.75,50.81 25.72,49.85 v25.72,44.45
IN_3  (via drill 0.6)
  Top 0.406: R2.1 v21.91,44.45 R9.2
  Bottom 0.406: CON1.3 21.25,50.51 21.91,49.85 v21.91,44.45
IN_4  (via drill 0.6)
  Top 0.406: R19.1 v16.51,44.45 R16.2
  Bottom 0.406: CON1.4 17.75,51.09 16.51,49.85 v16.51,44.45
IN_5  (via drill 0.6)
  Top 0.406: R22.1 v12.7,44.45 R17.2
  Bottom 0.406: CON1.5 14.25,51.4 12.7,49.85 v12.7,44.45
IN_6  (via drill 0.6)
  Top 0.406: R23.1 v8.89,44.45 R18.2
  Bottom 0.406: CON1.6 10.75,51.71 8.89,49.85 v8.89,44.45
N$1
  Top 0.406: R7.2 R8.1 50.95,54.77 49.85,55.88 49.23,55.88 IC1.1
N$2
  Top 0.406: R19.2 C17.1 14.29,41.74 IC3.1
N$4
  Top 0.406: C16.1 11.75,41.74 | 11.75,41.74 R22.2 | IC3.3 11.75,41.74
N$5
  Top 0.406: R33.2 C21.1 IC4.1
N$6
  Top 0.406: LED1.A 36.07,59.5 37.47,58.1 37.47,51.92 R1.2
N$8
  Top 0.406: IC1.3 47.94,57.94 R3.1 | 47.48,58.4 R3.1 | D2.A 45.74,58.42 47.62,58.42 R3.1
N$11
  Top 0.406: C20.1 R34.2 50.16,23.18 49.53,23.81 IC4.3
N$12
  Top 0.406: IC4.13 42.23,22.54 40.96,21.27 C24.1 R39.2
N$13
  Top 0.406: R6.2 R7.1
N$14
  Top 0.406: IC1.2 48.58,57.3 C5.1
N$15
  Top 0.406: R40.2 C23.1 IC4.11
N$16
  Top 0.406: R41.2 40.8,27.62 | 40.8,27.62 C22.1 | IC4.9 40.8,27.62
N$17
  Top 0.406: LED2.A R42.2
N$18
  Top 0.406: LED3.A 25.55,52.37 R43.2
N$19
  Top 0.406: LED4.A 22.05,52.37 R44.2
N$20
  Top 0.406: LED5.A 18.54,52.34 R45.2
N$21
  Top 0.406: LED6.A 15.05,52.35 R46.2
N$22
  Top 0.406: LED7.A 11.56,52.36 R47.2
N$23
  Top 0.406: R48.2 LED8.A
N$24
  Top 0.406: LED9.A 46.35,10.67 46.35,11.43 44.92,12.87 R49.2
N$25
  Top 0.406: R50.2 41.43,12.87 42.86,11.43 42.86,10.68 LED10.A
N$26
  Top 0.406: R51.2 37.94,12.87 39.37,11.43 39.37,10.69 LED11.A
N$27
  Top 0.406: R52.2 34.51,12.8 35.88,11.43 35.88,10.7 LED12.A
N$28
  Top 0.406: R53.2 31.02,12.8 32.38,11.43 32.38,10.7 LED13.A
N$29
  Top 0.406: R56.1 40.9,45.4 | 40.9,45.4 40.9,44.52 C26.1 40.88,42.78 R55.2 | IC7.6 40.9,45.4
N$30
  Top 0.406: R55.1 D3.A
N$31
  Top 0.406: LED16.C 21.93,13.83 R60.1
N$32
  Top 0.406: LED15.C 25.42,13.83 R59.1
N$33
  Top 0.406: LED14.C 28.91,13.83 R54.1
N$34
  Top 0.406: LED17.C 18.44,13.83 R61.1
N$35
  Top 0.406: LED18.C 14.95,13.83 R62.1
N$36
  Top 0.406: LED19.C 11.45,13.83 R63.1
N$40
  Top 0.406: IC2.1 27.3,41.43 C12.1 R20.2
N$41
  Top 0.406: C11.1 24.77,41.74 | 24.77,41.74 R21.2 | IC2.3 24.77,41.74
N$111
  Top 0.406: C19.1 R35.2 | R35.2 | IC4.5 49.53,26.35 50.16,26.99 R35.2
NEED_1
  Top 0.406: IC4.6 47.31,27.62 46.99,27.94 46.99,31.43 | 46.99,31.43 IC5.5 | 46.99,31.43 55.88,31.43 57.78,29.53 57.78,18.73 56.83,17.78 52.07,17.78 50.16,15.88 49.21,15.88 48.58,15.24 48.58,14.13 R48.1
NEED_2  (via drill 0.6)
  Top 0.406: IC4.2 47.62,22.54 46.99,21.91 46.99,17.46 | IC5.8 49.53,36.83 51.44,34.92 53.34,34.92 58.42,29.84 58.42,18.1 56.83,16.51 v52.39,16.51 | v50.16,17.46 46.99,17.46 | 46.99,17.46 46.99,15.24 46.67,14.92 46.67,14.12 R49.1
  Bottom 0.406: v50.16,17.46 51.44,17.46 v52.39,16.51
NEED_3
  Top 0.406: IC4.4 47.31,25.08 | 47.31,25.08 46.35,24.13 46.35,15.88 45.72,15.24 43.5,15.24 43.18,14.92 43.18,14.12 R50.1 | 47.31,25.08 46.35,26.04 46.35,27.62 45.72,28.26 IC5.4 45.72,32.91
NEED_4
  Top 0.406: IC4.8 44.13,28.89 | 44.13,28.89 45.72,27.3 45.72,16.83 44.77,15.88 40.32,15.88 39.69,15.24 39.69,14.61 39.69,14.12 R51.1 | 44.13,28.89 44.45,29.21 IC5.3
NEED_5  (via drill 0.6)
  Top 0.406: IC4.10 44.45,26.35 45.09,25.72 45.09,17.14 44.45,16.51 40.01,16.51 39.37,15.88 v36.2,15.88 36.2,14.1 R52.1 | v34.29,17.14 33.66,17.78 33.66,29.21 36.51,32.07 41.91,32.07 IC5.1
  Bottom 0.406: v36.2,15.88 35.56,15.88 v34.29,17.14
NEED_6
  Top 0.406: IC4.12 44.13,23.81 44.45,23.5 44.45,17.46 44.13,17.14 35.88,17.14 | IC5.2 43.18,31.43 42.86,31.11 36.51,31.11 34.29,28.89 34.29,18.73 35.88,17.14 | R53.1 32.62,14.84 33.02,15.24 33.97,15.24 35.88,17.14
OR_1
  Top 0.406: IC5.12 44.45,37.15 45.72,35.88 46.67,35.88 48.26,34.29 IC5.6
OR_2
  Top 0.406: IC5.9 48.26,37.15 47.94,36.83 46.04,36.83 45.72,37.15 IC5.11
REL_1
  Top 0.406: IC6.3 IC6.2 26.67,25.72 26.99,25.4 31.75,25.4 32.38,26.04 32.38,29.84 34.29,31.75 34.29,37.78 32.07,40.01 32.07,45.09 32.38,45.4 | R57.1 32.7,49.53 32.07,48.9 32.07,45.72 32.38,45.4 | 32.38,45.4 IC7.3
REL_2  (via drill 0.6)
  Top 0.406: R43.1 23.65,50.95 21.59,48.9 4.76,48.9 3.17,47.31 3.17,35.24 v4.45,33.97 | R12.2 R10.2 23.5,29.21 v22.86,28.57 IC6.5 IC6.4
  Bottom 0.406: v4.45,33.97 7.3,31.11 20.32,31.11 v22.86,28.57
REL_3  (via drill 0.6)
  Top 0.406: R44.1 20.16,50.95 18.73,49.53 4.45,49.53 2.54,47.62 2.54,33.97 v3.17,33.34 | R15.2 R13.2 19.68,29.21 v20.32,28.57 IC6.7 IC6.6
  Bottom 0.406: v3.17,33.34 6.03,30.48 18.41,30.48 v20.32,28.57
REL_4  (via drill 0.6)
  Top 0.406: R25.2 R24.2 14.29,29.21 v14.92,28.57 IC8.1 IC8.2 | R45.1 16.66,50.95 15.88,50.16 4.13,50.16 1.91,47.94 1.91,33.02 v3.17,31.75
  Bottom 0.406: v3.17,31.75 5.08,29.84 13.65,29.84 v14.92,28.57
REL_5  (via drill 0.6)
  Top 0.406: R27.2 R26.2 10.48,29.21 v11.11,28.57 IC8.4 IC8.3 | R46.1 13.17,51.27 12.7,50.8 3.81,50.8 1.27,48.26 1.27,31.75 v1.91,31.11
  Bottom 0.406: v1.91,31.11 4.45,28.57 v11.11,28.57
REL_6
  Top 0.406: IC8.5 IC8.6 IC8.7 7.3,28.57 6.67,29.21 R28.2 R29.2 4.61,29.84 1.59,29.84 0.64,30.8 0.64,48.58 3.81,51.75 9.53,51.75 9.68,51.91 R47.1
SIG_1
  Top 0.406: IC2.2 IC2.13 26.04,33.34 27.3,32.07 R4.1
SIG_2
  Top 0.406: IC2.4 IC2.11 R10.1
SIG_3
  Top 0.406: IC2.6 IC2.9 20.95,33.34 19.68,32.07 R13.1
SIG_4
  Top 0.406: IC3.2 IC3.13 13.02,33.34 14.29,32.07 R24.1
SIG_5
  Top 0.406: IC3.4 IC3.11 R26.1
SIG_6
  Top 0.406: IC3.6 IC3.9 7.94,33.34 6.67,32.07 R28.1
SWITCH
  Top 0.406: 45.4,46.99 45.4,46.06 L1.1
  Top 0.457: IC1.6 47.94,50.01 C6.2
  Top 1.016: C6.2 47.46,49.05 45.4,46.99
VIN  (via drill 0.6)
  Top 0.813: D1.A 39.69,68.58 39.37,68.9 v38.1,68.9 32.38,68.9 31.75,68.26 CON6.2
  Bottom 0.813: v38.1,68.9 32.38,68.9 31.75,68.26 31.75,66.04

### Text on the board
tPlace: Inputs | Power | Aux5 | Aux4 | Aux3 | Aux2 | Aux1 | Main | 24V | GND | NC | NO | Aux5 | Aux4 | Aux3 | Aux2 | Aux1 | Main | F | E | D | C | B | A | Outputs | Need Power